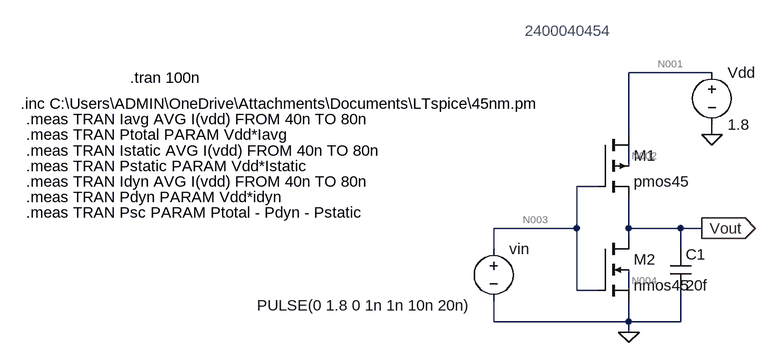
[diagram p0: schematic post2.asc]
post2.asc, the LTspice schematic file:
Version 4.1
SHEET 1 880 680
WIRE 336 -96 208 -96
WIRE 208 0 208 -96
WIRE 336 0 336 -16
WIRE 208 48 208 16
WIRE 160 80 128 80
WIRE 128 144 128 80
WIRE 128 144 0 144
WIRE 208 144 208 96
WIRE 288 144 208 144
WIRE 320 144 288 144
WIRE 208 160 208 144
WIRE 0 176 0 144
WIRE 288 176 288 144
WIRE 128 240 128 144
WIRE 160 240 128 240
WIRE 208 240 208 208
WIRE 0 288 0 256
WIRE 208 288 208 256
WIRE 208 288 0 288
WIRE 288 288 288 240
WIRE 288 288 208 288
WIRE 208 304 208 288
FLAG 208 304 0
FLAG 336 0 0
FLAG 320 144 Vout
IOPIN 320 144 Out
SYMBOL pmos4 160 0 R0
SYMATTR InstName M1
SYMATTR Value pmos45
SYMATTR Value2 l=45n w=1u
SYMBOL nmos4 160 160 R0
SYMATTR InstName M2
SYMATTR Value nmos45
SYMATTR Value2 l=45n w=1u
SYMBOL voltage 336 -112 R0
WINDOW 123 0 0 Left 0
WINDOW 39 0 0 Left 0
SYMATTR InstName Vdd
SYMATTR Value 1.8
SYMBOL voltage 0 160 R0
WINDOW 3 -364 103 Left 2
WINDOW 123 0 0 Left 0
WINDOW 39 0 0 Left 0
SYMATTR InstName vin
SYMATTR Value PULSE(0 1.8 0 1n 1n 10n 20n)
SYMBOL cap 272 176 R0
SYMATTR InstName C1
SYMATTR Value 20f
TEXT -720 -24 Left 2 !.meas TRAN Iavg AVG I(vdd) FROM 40n TO 80n
TEXT -720 0 Left 2 !.meas TRAN Ptotal PARAM Vdd*Iavg
TEXT -720 24 Left 2 !.meas TRAN Istatic AVG I(vdd) FROM 40n TO 80n
TEXT -720 48 Left 2 !.meas TRAN Pstatic PARAM Vdd*Istatic
TEXT -720 72 Left 2 !.meas TRAN Idyn AVG I(vdd) FROM 40n TO 80n
TEXT -720 96 Left 2 !.meas TRAN Pdyn PARAM Vdd*idyn
TEXT -720 120 Left 2 !.meas TRAN Psc PARAM Ptotal - Pdyn - Pstatic
TEXT -728 -48 Left 2 !.inc C:\\Users\\ADMIN\\OneDrive\\Attachments\\Documents\\LTspice\\45nm.pm
TEXT -560 -88 Left 2 !.tran 100n
TEXT 48 -160 Left 2 ;2400040454

The netlist it stands for:
* post2.asc
M1 N001 N003 Vout N002 pmos45 l=45n w=1u
M2 Vout N003 0 N004 nmos45 l=45n w=1u
Vdd N001 0 1.8
vin N003 0 PULSE(0 1.8 0 1n 1n 10n 20n)
C1 Vout 0 20f
.model NMOS NMOS
.model PMOS PMOS
.lib standard.mos
.meas TRAN Iavg AVG I(vdd) FROM 40n TO 80n
.meas TRAN Ptotal PARAM Vdd*Iavg
.meas TRAN Istatic AVG I(vdd) FROM 40n TO 80n
.meas TRAN Pstatic PARAM Vdd*Istatic
.meas TRAN Idyn AVG I(vdd) FROM 40n TO 80n
.meas TRAN Pdyn PARAM Vdd*idyn
.meas TRAN Psc PARAM Ptotal - Pdyn - Pstatic
.inc C:\Users\ADMIN\OneDrive\Attachments\Documents\LTspice\45nm.pm
.tran 100n
* 2400040454
.backanno
.end

* Results of the author's LTspice run, read from the files saved beside the schematic
* Operating Point, zero values left out:
*   V(n001) = 1.8 V
*   V(n002) = 1.467 V
*   V(n004) = 571.9 mV
*   V(vout) = 1.8 V
*   I(Vdd) = -461.2 nA
*   I(vin) = 4.634 nA
*   Ib(M1) = -1.474 pA
*   Id(M1) = 461.2 nA
*   Id(M2) = 456.6 nA
*   Ig(M1) = -4.634 nA
*   Is(M1) = -456.6 nA
*   Is(M2) = -456.6 nA
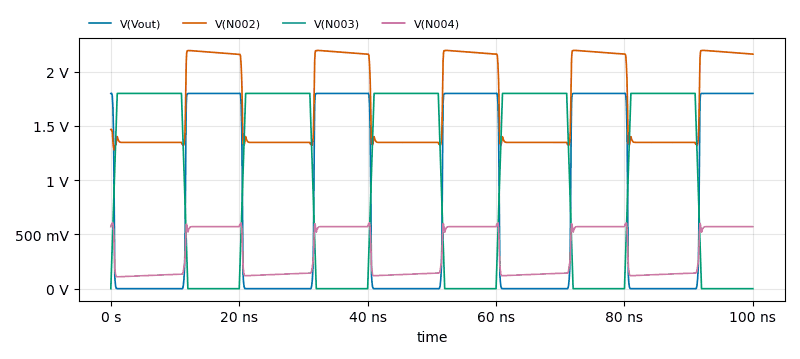
[diagram p1: Transient Analysis of post2.asc, plotted from the saved traces]
* Transient Analysis, 1 run:
*   V(Vout): min -1.289 mV, max 1.802 V, average 797.8 mV, rms 1.19 V, last 1.8 V
*   V(N002): min 1.278 V, max 2.197 V, average 1.71 V, rms 1.758 V, last 2.162 V
*   V(N003): min 0 V, max 1.8 V, average 990 mV, rms 1.315 V, last 0 V
*   V(N004): min 109.3 mV, max 609.7 mV, average 328.4 mV, rms 393.8 mV, last 571.9 mV